# Altium schematic sheet LM2596 AMS1117.SchDoc
size A
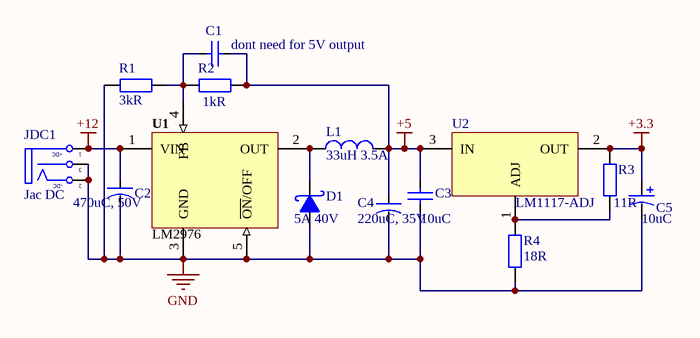
[diagram p0: LM2596 AMS1117.SchDoc]

## Parts
C1  dont need for 5V output  [CAP_0402]
C2  470uC, 50V  [CA-ALU-2.54]
C3  10uC  [CAP_0402]
C4  220uC, 35V  [CA-ALU-2.54]
C5  10uC  [CAP_7343]
D1  5A 40V  [DIO-3A]
JDC1  Jac DC  [DC-IN]
L1  33uH 3.5A  [L-SMD-M-12x10]
R1  3kR  [RES-SMD-0101]
R2  1kR  [RES-SMD-0101]
R3  11R  [RES-SMD-0101]
R4  18R  [RES-SMD-0101]
U1  LM2976  [TO-263]
U2  LM1117-ADJ  [LM1117-SOP]

## Nets
+3.3: C5.1 R3.1 U2.2(OUT)
+5: C1.2 C3.2 C4.1 L1.2 R2.1 U2.3(IN)
+12: C2.1 JDC1.1(T) U1.1(VIN)
GND: C2.2 C3.1 C4.2 C5.2 D1.1(A) JDC1.2(TN) JDC1.3(S) R1.2 R4.2 U1.3(GND) U1.5(~{ON}/OFF)
NetC1_1: C1.1 R1.1 R2.2 U1.4(FB)
NetD1_2: D1.2(K) L1.1 U1.2(OUT)
NetR3_2: R3.2 R4.1 U2.1(ADJ)

## Notes on the sheet
- (in symbol DCIN) +DC; -DC

## Library data of the parts
C1 C3 = CapSMD: Capacitor; Value: 33p; Published: 8-Jun-2000; LatestRevisionDate: 17-Jul-2002; LatestRevisionNote: Re-released for DXP Platform.; PackageReference: RAD-0.3; Publisher: Altium Limited
C2 C4 = CAP-ALU-DIP: Capacitor (Semiconductor SIM Model); Value: 104; LatestRevisionDate: 17-Jul-2002; LatestRevisionNote: Re-released for DXP Platform.; PackageReference: C1206; Publisher: Altium Limited
C5 = CAP_TAN_SMD: Polazied Tantalum Capacitor
D1 = Diode Schottky: Generic Diode Schottky
JDC1 = DCIN: Jac DC input; Value: Jac DC
L1 = Inductor: Value: 150 mH
R1-R4 = Resistor - SMD: Resistor SMD; Manufacturer: Generic Components; Class: Passive; Published: 08/06/2000; Publisher: Altium Hobart Technology Centre
U1 = LM2596: Max Input Voltage: 12 V; Max Output Current: 3 (6.0 peak) A; Max Output Voltage: mV; Category: IC-Power; Min Input Voltage: mV; Min Output Voltage: mV; Mounting Technology: Surface Mount; Status: Unreleased; Supply Voltage: mV; Temperature Range: -40 to +125 degC
U2 = LM1117-ADJ: 800mA Low-Dropout Linear Regulator; Creator: Nguyen Ba Bien; Website: http://group3i.net